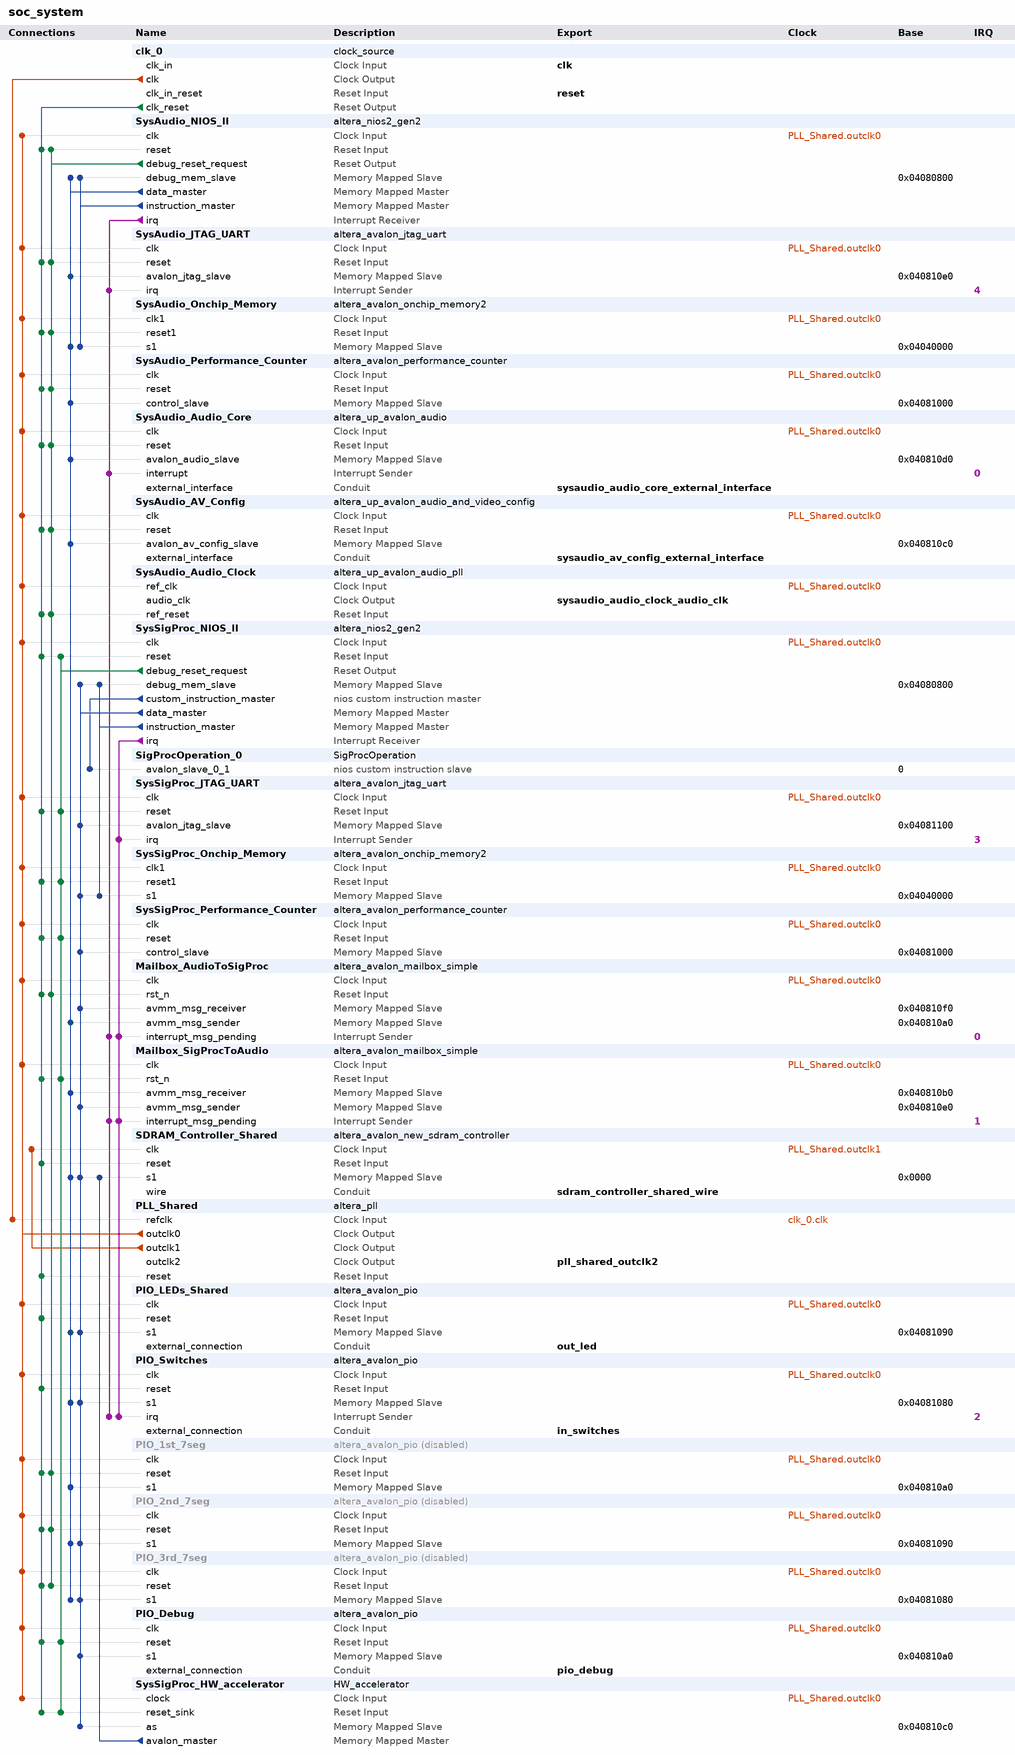
[diagram p0: system contents]
# Platform Designer (Qsys) system soc_system, Cyclone V 5CSEMA5F31C6
# Parameters at their usual value, and those the tool derives, are not listed.
package require -exact qsys 18.1
create_system soc_system
set_project_property DEVICE_FAMILY {Cyclone V}
set_project_property DEVICE 5CSEMA5F31C6

add_instance clk_0 clock_source 18.1
set_instance_parameter_value clk_0 clockFrequency 50000000

add_instance SysAudio_NIOS_II altera_nios2_gen2 18.1
set_instance_parameter_value SysAudio_NIOS_II dcache_size 2048
set_instance_parameter_value SysAudio_NIOS_II exceptionSlave SysAudio_Onchip_Memory.s1
set_instance_parameter_value SysAudio_NIOS_II icache_size 4096
set_instance_parameter_value SysAudio_NIOS_II impl Fast
set_instance_parameter_value SysAudio_NIOS_II resetSlave SysAudio_Onchip_Memory.s1

add_instance SysAudio_JTAG_UART altera_avalon_jtag_uart 18.1
set_instance_parameter_value SysAudio_JTAG_UART simInteractiveOptions NO_INTERACTIVE_WINDOWS

add_instance SysAudio_Onchip_Memory altera_avalon_onchip_memory2 18.1
set_instance_parameter_value SysAudio_Onchip_Memory dataWidth 32
set_instance_parameter_value SysAudio_Onchip_Memory dualPort false
set_instance_parameter_value SysAudio_Onchip_Memory initMemContent true
set_instance_parameter_value SysAudio_Onchip_Memory initializationFileName onchip_mem.hex
set_instance_parameter_value SysAudio_Onchip_Memory memorySize 174080

add_instance SysAudio_Performance_Counter altera_avalon_performance_counter 18.1
set_instance_parameter_value SysAudio_Performance_Counter numberOfSections 7

add_instance SysAudio_Audio_Core altera_up_avalon_audio 18.0
set_instance_parameter_value SysAudio_Audio_Core audio_in true
set_instance_parameter_value SysAudio_Audio_Core avalon_bus_type {Memory Mapped}
set_instance_parameter_value SysAudio_Audio_Core dw 32

add_instance SysAudio_AV_Config altera_up_avalon_audio_and_video_config 18.0
set_instance_parameter_value SysAudio_AV_Config audio_in {Microphone to ADC}
set_instance_parameter_value SysAudio_AV_Config bit_length 32
set_instance_parameter_value SysAudio_AV_Config board DE1-SoC
set_instance_parameter_value SysAudio_AV_Config line_in_bypass false
set_instance_parameter_value SysAudio_AV_Config sampling_rate {48 kHz}

add_instance SysAudio_Audio_Clock altera_up_avalon_audio_pll 18.0
set_instance_parameter_value SysAudio_Audio_Clock gui_refclk 50.0

add_instance SysSigProc_NIOS_II altera_nios2_gen2 18.1
set_instance_parameter_value SysSigProc_NIOS_II cpuID 1
set_instance_parameter_value SysSigProc_NIOS_II dcache_size 2048
set_instance_parameter_value SysSigProc_NIOS_II exceptionSlave SysSigProc_Onchip_Memory.s1
set_instance_parameter_value SysSigProc_NIOS_II icache_size 4096
set_instance_parameter_value SysSigProc_NIOS_II impl Fast
set_instance_parameter_value SysSigProc_NIOS_II resetSlave SysSigProc_Onchip_Memory.s1

add_instance SigProcOperation_0 SigProcOperation 1.0

add_instance SysSigProc_JTAG_UART altera_avalon_jtag_uart 18.1
set_instance_parameter_value SysSigProc_JTAG_UART simInteractiveOptions NO_INTERACTIVE_WINDOWS

add_instance SysSigProc_Onchip_Memory altera_avalon_onchip_memory2 18.1
set_instance_parameter_value SysSigProc_Onchip_Memory dataWidth 32
set_instance_parameter_value SysSigProc_Onchip_Memory dualPort false
set_instance_parameter_value SysSigProc_Onchip_Memory initMemContent true
set_instance_parameter_value SysSigProc_Onchip_Memory initializationFileName onchip_mem.hex
set_instance_parameter_value SysSigProc_Onchip_Memory memorySize 174080

add_instance SysSigProc_Performance_Counter altera_avalon_performance_counter 18.1
set_instance_parameter_value SysSigProc_Performance_Counter numberOfSections 7

add_instance Mailbox_AudioToSigProc altera_avalon_mailbox_simple 18.1
set_instance_parameter_value Mailbox_AudioToSigProc AWIDTH 2
set_instance_parameter_value Mailbox_AudioToSigProc DWIDTH 32
set_instance_parameter_value Mailbox_AudioToSigProc MSG_ARRIVAL_NOTIFY 1
set_instance_parameter_value Mailbox_AudioToSigProc MSG_SPACE_NOTIFY 0

add_instance Mailbox_SigProcToAudio altera_avalon_mailbox_simple 18.1
set_instance_parameter_value Mailbox_SigProcToAudio AWIDTH 2
set_instance_parameter_value Mailbox_SigProcToAudio DWIDTH 32
set_instance_parameter_value Mailbox_SigProcToAudio MSG_ARRIVAL_NOTIFY 1
set_instance_parameter_value Mailbox_SigProcToAudio MSG_SPACE_NOTIFY 0

add_instance SDRAM_Controller_Shared altera_avalon_new_sdram_controller 18.1
set_instance_parameter_value SDRAM_Controller_Shared TAC 5.4
set_instance_parameter_value SDRAM_Controller_Shared TRCD 15.0
set_instance_parameter_value SDRAM_Controller_Shared TRP 15.0
set_instance_parameter_value SDRAM_Controller_Shared casLatency 3
set_instance_parameter_value SDRAM_Controller_Shared columnWidth 10
set_instance_parameter_value SDRAM_Controller_Shared dataWidth 16
set_instance_parameter_value SDRAM_Controller_Shared generateSimulationModel false
set_instance_parameter_value SDRAM_Controller_Shared model single_Micron_MT48LC4M32B2_7_chip
set_instance_parameter_value SDRAM_Controller_Shared numberOfBanks 4
set_instance_parameter_value SDRAM_Controller_Shared numberOfChipSelects 1
set_instance_parameter_value SDRAM_Controller_Shared powerUpDelay 100.0
set_instance_parameter_value SDRAM_Controller_Shared refreshPeriod 7.8125
set_instance_parameter_value SDRAM_Controller_Shared rowWidth 13

add_instance PLL_Shared altera_pll 18.1
set_instance_parameter_value PLL_Shared gui_device_speed_grade 1
set_instance_parameter_value PLL_Shared gui_number_of_clocks 3
set_instance_parameter_value PLL_Shared gui_operation_mode direct
set_instance_parameter_value PLL_Shared gui_output_clock_frequency0 50.0
set_instance_parameter_value PLL_Shared gui_output_clock_frequency1 100.0
set_instance_parameter_value PLL_Shared gui_output_clock_frequency2 100.0
set_instance_parameter_value PLL_Shared gui_phase_shift2 -3758
set_instance_parameter_value PLL_Shared gui_pll_mode {Integer-N PLL}
set_instance_parameter_value PLL_Shared gui_reference_clock_frequency 100.0
set_instance_parameter_value PLL_Shared gui_use_locked false

add_instance PIO_LEDs_Shared altera_avalon_pio 18.1
set_instance_parameter_value PIO_LEDs_Shared direction Output
set_instance_parameter_value PIO_LEDs_Shared width 10

add_instance PIO_Switches altera_avalon_pio 18.1
set_instance_parameter_value PIO_Switches bitClearingEdgeCapReg true
set_instance_parameter_value PIO_Switches captureEdge true
set_instance_parameter_value PIO_Switches direction Input
set_instance_parameter_value PIO_Switches generateIRQ true
set_instance_parameter_value PIO_Switches irqType EDGE
set_instance_parameter_value PIO_Switches width 8

add_instance PIO_1st_7seg altera_avalon_pio 18.1
set_instance_property PIO_1st_7seg ENABLED false
set_instance_parameter_value PIO_1st_7seg direction Output
set_instance_parameter_value PIO_1st_7seg width 14

add_instance PIO_2nd_7seg altera_avalon_pio 18.1
set_instance_property PIO_2nd_7seg ENABLED false
set_instance_parameter_value PIO_2nd_7seg direction Output
set_instance_parameter_value PIO_2nd_7seg width 14

add_instance PIO_3rd_7seg altera_avalon_pio 18.1
set_instance_property PIO_3rd_7seg ENABLED false
set_instance_parameter_value PIO_3rd_7seg direction Output
set_instance_parameter_value PIO_3rd_7seg width 14

add_instance PIO_Debug altera_avalon_pio 18.1
set_instance_parameter_value PIO_Debug bitModifyingOutReg true
set_instance_parameter_value PIO_Debug direction Output
set_instance_parameter_value PIO_Debug width 32

add_instance SysSigProc_HW_accelerator HW_accelerator 1.0

# connections
add_connection clk_0.clk PLL_Shared.refclk clock
add_connection PLL_Shared.outclk0 Mailbox_AudioToSigProc.clk clock
add_connection PLL_Shared.outclk0 Mailbox_SigProcToAudio.clk clock
add_connection PLL_Shared.outclk0 PIO_1st_7seg.clk clock
add_connection PLL_Shared.outclk0 PIO_2nd_7seg.clk clock
add_connection PLL_Shared.outclk0 PIO_3rd_7seg.clk clock
add_connection PLL_Shared.outclk0 PIO_Debug.clk clock
add_connection PLL_Shared.outclk0 PIO_LEDs_Shared.clk clock
add_connection PLL_Shared.outclk0 PIO_Switches.clk clock
add_connection PLL_Shared.outclk0 SysAudio_Audio_Clock.ref_clk clock
add_connection PLL_Shared.outclk0 SysAudio_Audio_Core.clk clock
add_connection PLL_Shared.outclk0 SysAudio_AV_Config.clk clock
add_connection PLL_Shared.outclk0 SysAudio_JTAG_UART.clk clock
add_connection PLL_Shared.outclk0 SysAudio_NIOS_II.clk clock
add_connection PLL_Shared.outclk0 SysAudio_Onchip_Memory.clk1 clock
add_connection PLL_Shared.outclk0 SysAudio_Performance_Counter.clk clock
add_connection PLL_Shared.outclk0 SysSigProc_HW_accelerator.clock clock
add_connection PLL_Shared.outclk0 SysSigProc_JTAG_UART.clk clock
add_connection PLL_Shared.outclk0 SysSigProc_NIOS_II.clk clock
add_connection PLL_Shared.outclk0 SysSigProc_Onchip_Memory.clk1 clock
add_connection PLL_Shared.outclk0 SysSigProc_Performance_Counter.clk clock
add_connection PLL_Shared.outclk1 SDRAM_Controller_Shared.clk clock
add_connection clk_0.clk_reset Mailbox_AudioToSigProc.rst_n reset
add_connection clk_0.clk_reset Mailbox_SigProcToAudio.rst_n reset
add_connection clk_0.clk_reset PIO_1st_7seg.reset reset
add_connection clk_0.clk_reset PIO_2nd_7seg.reset reset
add_connection clk_0.clk_reset PIO_3rd_7seg.reset reset
add_connection clk_0.clk_reset PIO_Debug.reset reset
add_connection clk_0.clk_reset PIO_LEDs_Shared.reset reset
add_connection clk_0.clk_reset PIO_Switches.reset reset
add_connection clk_0.clk_reset PLL_Shared.reset reset
add_connection clk_0.clk_reset SDRAM_Controller_Shared.reset reset
add_connection clk_0.clk_reset SysAudio_Audio_Clock.ref_reset reset
add_connection clk_0.clk_reset SysAudio_Audio_Core.reset reset
add_connection clk_0.clk_reset SysAudio_AV_Config.reset reset
add_connection clk_0.clk_reset SysAudio_JTAG_UART.reset reset
add_connection clk_0.clk_reset SysAudio_NIOS_II.reset reset
add_connection clk_0.clk_reset SysAudio_Onchip_Memory.reset1 reset
add_connection clk_0.clk_reset SysAudio_Performance_Counter.reset reset
add_connection clk_0.clk_reset SysSigProc_HW_accelerator.reset_sink reset
add_connection clk_0.clk_reset SysSigProc_JTAG_UART.reset reset
add_connection clk_0.clk_reset SysSigProc_NIOS_II.reset reset
add_connection clk_0.clk_reset SysSigProc_Onchip_Memory.reset1 reset
add_connection clk_0.clk_reset SysSigProc_Performance_Counter.reset reset
add_connection SysAudio_NIOS_II.debug_reset_request Mailbox_AudioToSigProc.rst_n reset
add_connection SysAudio_NIOS_II.debug_reset_request PIO_1st_7seg.reset reset
add_connection SysAudio_NIOS_II.debug_reset_request PIO_2nd_7seg.reset reset
add_connection SysAudio_NIOS_II.debug_reset_request PIO_3rd_7seg.reset reset
add_connection SysAudio_NIOS_II.debug_reset_request SysAudio_Audio_Clock.ref_reset reset
add_connection SysAudio_NIOS_II.debug_reset_request SysAudio_Audio_Core.reset reset
add_connection SysAudio_NIOS_II.debug_reset_request SysAudio_AV_Config.reset reset
add_connection SysAudio_NIOS_II.debug_reset_request SysAudio_JTAG_UART.reset reset
add_connection SysAudio_NIOS_II.debug_reset_request SysAudio_NIOS_II.reset reset
add_connection SysAudio_NIOS_II.debug_reset_request SysAudio_Onchip_Memory.reset1 reset
add_connection SysAudio_NIOS_II.debug_reset_request SysAudio_Performance_Counter.reset reset
add_connection SysSigProc_NIOS_II.debug_reset_request Mailbox_SigProcToAudio.rst_n reset
add_connection SysSigProc_NIOS_II.debug_reset_request PIO_Debug.reset reset
add_connection SysSigProc_NIOS_II.debug_reset_request SysSigProc_HW_accelerator.reset_sink reset
add_connection SysSigProc_NIOS_II.debug_reset_request SysSigProc_JTAG_UART.reset reset
add_connection SysSigProc_NIOS_II.debug_reset_request SysSigProc_NIOS_II.reset reset
add_connection SysSigProc_NIOS_II.debug_reset_request SysSigProc_Onchip_Memory.reset1 reset
add_connection SysSigProc_NIOS_II.debug_reset_request SysSigProc_Performance_Counter.reset reset
add_connection SysAudio_NIOS_II.data_master Mailbox_AudioToSigProc.avmm_msg_sender avalon
set_connection_parameter_value SysAudio_NIOS_II.data_master/Mailbox_AudioToSigProc.avmm_msg_sender baseAddress 0x040810a0
add_connection SysAudio_NIOS_II.data_master Mailbox_SigProcToAudio.avmm_msg_receiver avalon
set_connection_parameter_value SysAudio_NIOS_II.data_master/Mailbox_SigProcToAudio.avmm_msg_receiver baseAddress 0x040810b0
add_connection SysAudio_NIOS_II.data_master PIO_1st_7seg.s1 avalon
set_connection_parameter_value SysAudio_NIOS_II.data_master/PIO_1st_7seg.s1 baseAddress 0x040810a0
add_connection SysAudio_NIOS_II.data_master PIO_2nd_7seg.s1 avalon
set_connection_parameter_value SysAudio_NIOS_II.data_master/PIO_2nd_7seg.s1 baseAddress 0x04081090
add_connection SysAudio_NIOS_II.data_master PIO_3rd_7seg.s1 avalon
set_connection_parameter_value SysAudio_NIOS_II.data_master/PIO_3rd_7seg.s1 baseAddress 0x04081080
add_connection SysAudio_NIOS_II.data_master PIO_LEDs_Shared.s1 avalon
set_connection_parameter_value SysAudio_NIOS_II.data_master/PIO_LEDs_Shared.s1 baseAddress 0x04081090
add_connection SysAudio_NIOS_II.data_master PIO_Switches.s1 avalon
set_connection_parameter_value SysAudio_NIOS_II.data_master/PIO_Switches.s1 baseAddress 0x04081080
add_connection SysAudio_NIOS_II.data_master SDRAM_Controller_Shared.s1 avalon
set_connection_parameter_value SysAudio_NIOS_II.data_master/SDRAM_Controller_Shared.s1 baseAddress 0x0000
add_connection SysAudio_NIOS_II.data_master SysAudio_Audio_Core.avalon_audio_slave avalon
set_connection_parameter_value SysAudio_NIOS_II.data_master/SysAudio_Audio_Core.avalon_audio_slave baseAddress 0x040810d0
add_connection SysAudio_NIOS_II.data_master SysAudio_AV_Config.avalon_av_config_slave avalon
set_connection_parameter_value SysAudio_NIOS_II.data_master/SysAudio_AV_Config.avalon_av_config_slave baseAddress 0x040810c0
add_connection SysAudio_NIOS_II.data_master SysAudio_JTAG_UART.avalon_jtag_slave avalon
set_connection_parameter_value SysAudio_NIOS_II.data_master/SysAudio_JTAG_UART.avalon_jtag_slave baseAddress 0x040810e0
add_connection SysAudio_NIOS_II.data_master SysAudio_NIOS_II.debug_mem_slave avalon
set_connection_parameter_value SysAudio_NIOS_II.data_master/SysAudio_NIOS_II.debug_mem_slave baseAddress 0x04080800
add_connection SysAudio_NIOS_II.data_master SysAudio_Onchip_Memory.s1 avalon
set_connection_parameter_value SysAudio_NIOS_II.data_master/SysAudio_Onchip_Memory.s1 baseAddress 0x04040000
add_connection SysAudio_NIOS_II.data_master SysAudio_Performance_Counter.control_slave avalon
set_connection_parameter_value SysAudio_NIOS_II.data_master/SysAudio_Performance_Counter.control_slave baseAddress 0x04081000
add_connection SysAudio_NIOS_II.instruction_master SysAudio_NIOS_II.debug_mem_slave avalon
set_connection_parameter_value SysAudio_NIOS_II.instruction_master/SysAudio_NIOS_II.debug_mem_slave baseAddress 0x04080800
add_connection SysAudio_NIOS_II.instruction_master SysAudio_Onchip_Memory.s1 avalon
set_connection_parameter_value SysAudio_NIOS_II.instruction_master/SysAudio_Onchip_Memory.s1 baseAddress 0x04040000
add_connection SysSigProc_HW_accelerator.avalon_master SDRAM_Controller_Shared.s1 avalon
set_connection_parameter_value SysSigProc_HW_accelerator.avalon_master/SDRAM_Controller_Shared.s1 baseAddress 0x0000
add_connection SysSigProc_NIOS_II.data_master Mailbox_AudioToSigProc.avmm_msg_receiver avalon
set_connection_parameter_value SysSigProc_NIOS_II.data_master/Mailbox_AudioToSigProc.avmm_msg_receiver baseAddress 0x040810f0
add_connection SysSigProc_NIOS_II.data_master Mailbox_SigProcToAudio.avmm_msg_sender avalon
set_connection_parameter_value SysSigProc_NIOS_II.data_master/Mailbox_SigProcToAudio.avmm_msg_sender baseAddress 0x040810e0
add_connection SysSigProc_NIOS_II.data_master PIO_2nd_7seg.s1 avalon
set_connection_parameter_value SysSigProc_NIOS_II.data_master/PIO_2nd_7seg.s1 baseAddress 0x04081090
add_connection SysSigProc_NIOS_II.data_master PIO_3rd_7seg.s1 avalon
set_connection_parameter_value SysSigProc_NIOS_II.data_master/PIO_3rd_7seg.s1 baseAddress 0x04081080
add_connection SysSigProc_NIOS_II.data_master PIO_Debug.s1 avalon
set_connection_parameter_value SysSigProc_NIOS_II.data_master/PIO_Debug.s1 baseAddress 0x040810a0
add_connection SysSigProc_NIOS_II.data_master PIO_LEDs_Shared.s1 avalon
set_connection_parameter_value SysSigProc_NIOS_II.data_master/PIO_LEDs_Shared.s1 baseAddress 0x04081090
add_connection SysSigProc_NIOS_II.data_master PIO_Switches.s1 avalon
set_connection_parameter_value SysSigProc_NIOS_II.data_master/PIO_Switches.s1 baseAddress 0x04081080
add_connection SysSigProc_NIOS_II.data_master SDRAM_Controller_Shared.s1 avalon
set_connection_parameter_value SysSigProc_NIOS_II.data_master/SDRAM_Controller_Shared.s1 baseAddress 0x0000
add_connection SysSigProc_NIOS_II.data_master SysSigProc_HW_accelerator.as avalon
set_connection_parameter_value SysSigProc_NIOS_II.data_master/SysSigProc_HW_accelerator.as baseAddress 0x040810c0
add_connection SysSigProc_NIOS_II.data_master SysSigProc_JTAG_UART.avalon_jtag_slave avalon
set_connection_parameter_value SysSigProc_NIOS_II.data_master/SysSigProc_JTAG_UART.avalon_jtag_slave baseAddress 0x04081100
add_connection SysSigProc_NIOS_II.data_master SysSigProc_NIOS_II.debug_mem_slave avalon
set_connection_parameter_value SysSigProc_NIOS_II.data_master/SysSigProc_NIOS_II.debug_mem_slave baseAddress 0x04080800
add_connection SysSigProc_NIOS_II.data_master SysSigProc_Onchip_Memory.s1 avalon
set_connection_parameter_value SysSigProc_NIOS_II.data_master/SysSigProc_Onchip_Memory.s1 baseAddress 0x04040000
add_connection SysSigProc_NIOS_II.data_master SysSigProc_Performance_Counter.control_slave avalon
set_connection_parameter_value SysSigProc_NIOS_II.data_master/SysSigProc_Performance_Counter.control_slave baseAddress 0x04081000
add_connection SysSigProc_NIOS_II.instruction_master SysSigProc_NIOS_II.debug_mem_slave avalon
set_connection_parameter_value SysSigProc_NIOS_II.instruction_master/SysSigProc_NIOS_II.debug_mem_slave baseAddress 0x04080800
add_connection SysSigProc_NIOS_II.instruction_master SysSigProc_Onchip_Memory.s1 avalon
set_connection_parameter_value SysSigProc_NIOS_II.instruction_master/SysSigProc_Onchip_Memory.s1 baseAddress 0x04040000
add_connection SysAudio_NIOS_II.irq Mailbox_AudioToSigProc.interrupt_msg_pending interrupt
set_connection_parameter_value SysAudio_NIOS_II.irq/Mailbox_AudioToSigProc.interrupt_msg_pending irqNumber 2
add_connection SysAudio_NIOS_II.irq Mailbox_SigProcToAudio.interrupt_msg_pending interrupt
set_connection_parameter_value SysAudio_NIOS_II.irq/Mailbox_SigProcToAudio.interrupt_msg_pending irqNumber 1
add_connection SysAudio_NIOS_II.irq PIO_Switches.irq interrupt
set_connection_parameter_value SysAudio_NIOS_II.irq/PIO_Switches.irq irqNumber 3
add_connection SysAudio_NIOS_II.irq SysAudio_Audio_Core.interrupt interrupt
set_connection_parameter_value SysAudio_NIOS_II.irq/SysAudio_Audio_Core.interrupt irqNumber 0
add_connection SysAudio_NIOS_II.irq SysAudio_JTAG_UART.irq interrupt
set_connection_parameter_value SysAudio_NIOS_II.irq/SysAudio_JTAG_UART.irq irqNumber 4
add_connection SysSigProc_NIOS_II.irq Mailbox_AudioToSigProc.interrupt_msg_pending interrupt
set_connection_parameter_value SysSigProc_NIOS_II.irq/Mailbox_AudioToSigProc.interrupt_msg_pending irqNumber 0
add_connection SysSigProc_NIOS_II.irq Mailbox_SigProcToAudio.interrupt_msg_pending interrupt
set_connection_parameter_value SysSigProc_NIOS_II.irq/Mailbox_SigProcToAudio.interrupt_msg_pending irqNumber 1
add_connection SysSigProc_NIOS_II.irq PIO_Switches.irq interrupt
set_connection_parameter_value SysSigProc_NIOS_II.irq/PIO_Switches.irq irqNumber 2
add_connection SysSigProc_NIOS_II.irq SysSigProc_JTAG_UART.irq interrupt
set_connection_parameter_value SysSigProc_NIOS_II.irq/SysSigProc_JTAG_UART.irq irqNumber 3
add_connection SysSigProc_NIOS_II.custom_instruction_master SigProcOperation_0.avalon_slave_0_1 nios_custom_instruction
set_connection_parameter_value SysSigProc_NIOS_II.custom_instruction_master/SigProcOperation_0.avalon_slave_0_1 CIName sigprocoperation_0
set_connection_parameter_value SysSigProc_NIOS_II.custom_instruction_master/SigProcOperation_0.avalon_slave_0_1 baseAddress 0

# exported interfaces
add_interface clk clock sink
set_interface_property clk EXPORT_OF clk_0.clk_in
add_interface in_switches conduit end
set_interface_property in_switches EXPORT_OF PIO_Switches.external_connection
add_interface out_led conduit end
set_interface_property out_led EXPORT_OF PIO_LEDs_Shared.external_connection
add_interface pio_debug conduit end
set_interface_property pio_debug EXPORT_OF PIO_Debug.external_connection
add_interface pll_shared_outclk2 clock source
set_interface_property pll_shared_outclk2 EXPORT_OF PLL_Shared.outclk2
add_interface reset reset sink
set_interface_property reset EXPORT_OF clk_0.clk_in_reset
add_interface sdram_controller_shared_wire conduit end
set_interface_property sdram_controller_shared_wire EXPORT_OF SDRAM_Controller_Shared.wire
add_interface sysaudio_audio_clock_audio_clk clock source
set_interface_property sysaudio_audio_clock_audio_clk EXPORT_OF SysAudio_Audio_Clock.audio_clk
add_interface sysaudio_audio_core_external_interface conduit end
set_interface_property sysaudio_audio_core_external_interface EXPORT_OF SysAudio_Audio_Core.external_interface
add_interface sysaudio_av_config_external_interface conduit end
set_interface_property sysaudio_av_config_external_interface EXPORT_OF SysAudio_AV_Config.external_interface

set_interconnect_requirement {$system} qsys_mm.clockCrossingAdapter HANDSHAKE
set_interconnect_requirement {$system} qsys_mm.enableEccProtection FALSE
set_interconnect_requirement {$system} qsys_mm.insertDefaultSlave FALSE
set_interconnect_requirement {$system} qsys_mm.maxAdditionalLatency 1

save_system soc_system.qsys
